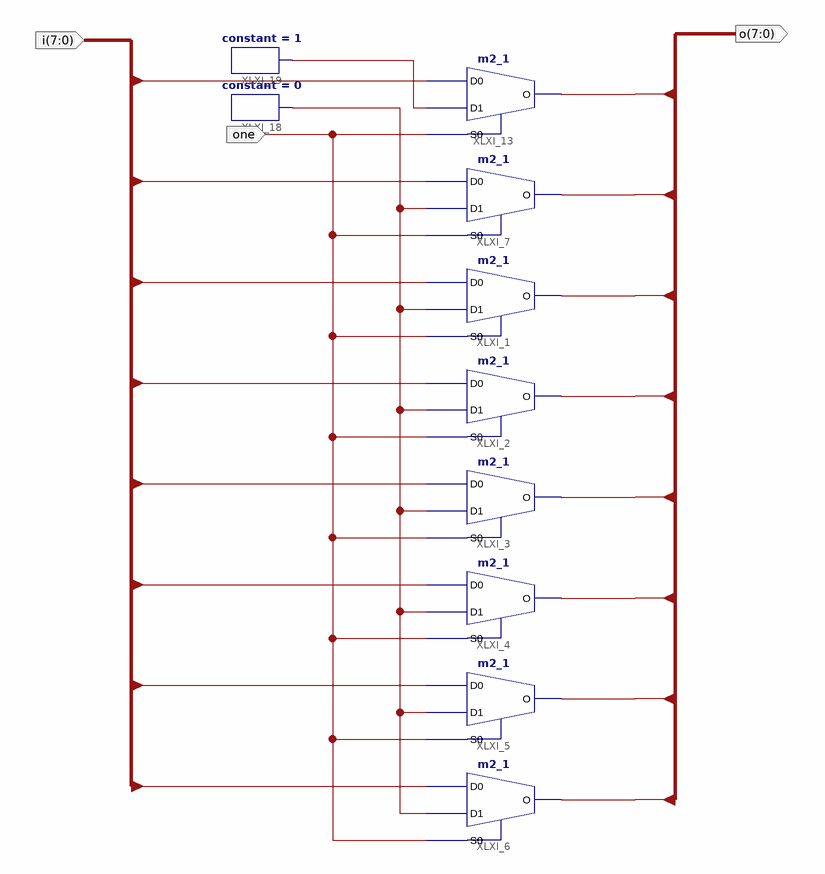
[diagram p0: schematic sheet 1]
// Xilinx ISE schematic pass_through_or_port_base.sch (aspartan6) as structural Verilog: 10 symbols, 3 ports
module pass_through_or_port_base (
  input  one,
  input  [7:0] i,
  output [7:0] o
);

  wire const_one, const_zero;

  m2_1 XLXI_1 (.D0(i[2]), .D1(const_zero), .S0(one), .O(o[2]));
  m2_1 XLXI_2 (.D0(i[3]), .D1(const_zero), .S0(one), .O(o[3]));
  m2_1 XLXI_3 (.D0(i[4]), .D1(const_zero), .S0(one), .O(o[4]));
  m2_1 XLXI_4 (.D0(i[5]), .D1(const_zero), .S0(one), .O(o[5]));
  m2_1 XLXI_5 (.D0(i[6]), .D1(const_zero), .S0(one), .O(o[6]));
  m2_1 XLXI_6 (.D0(i[7]), .D1(const_zero), .S0(one), .O(o[7]));
  m2_1 XLXI_7 (.D0(i[1]), .D1(const_zero), .S0(one), .O(o[1]));
  m2_1 XLXI_13 (.D0(i[0]), .D1(const_one), .S0(one), .O(o[0]));
  constant #(.CValue("0")) XLXI_18 (.O(const_zero));
  constant #(.CValue("1")) XLXI_19 (.O(const_one));
endmodule
